# Altium schematic sheet CAM_BRD.SchDoc: SBC CAM BOARD
size Tabloid; CompanyName: Romtech; DrawnBy: FKA; DocumentNumber: 16016; Revision: 2; SheetNumber: 1; SheetTotal: 1
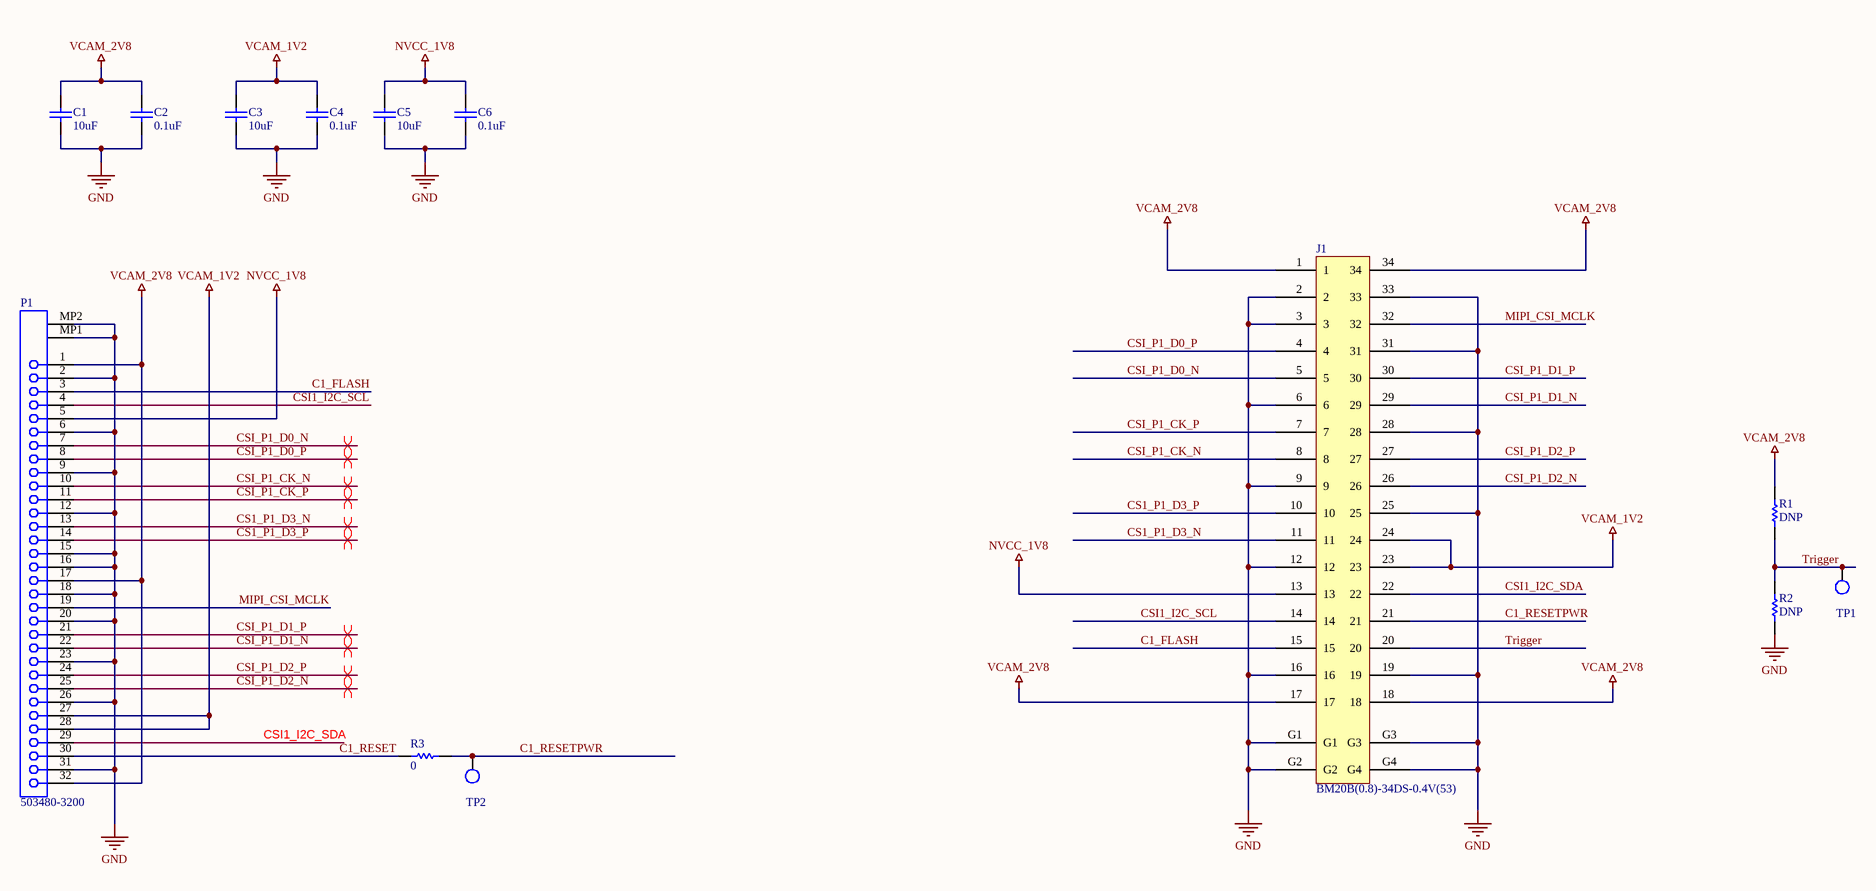
[diagram p0: CAM_BRD.SchDoc]

## Parts
C1  10uF  [CAPC0402X06N]
C2  0.1uF  [CAPC0402X06N]
C3  10uF  [CAPC0402X06N]
C4  0.1uF  [CAPC0402X06N]
C5  10uF  [CAPC0402X06N]
C6  0.1uF  [CAPC0402X06N]
J1  BM20B(0.8)-34DS-0.4V(53)  [BM20]
P1  503480-3200  [32POS-0.5MM PITCH]
R1  DNP  [RESC0402X04N]
R2  DNP  [RESC0402X04N]
R3  0  [RESC0603X06N]
TP1  (no value)  [Test Point]  (no BOM)
TP2  (no value)  [Test Point]  (no BOM)

## Nets
GND: C1.1 C2.1 C3.1 C4.1 C5.1 C6.1 J1.2 J1.3 J1.6 J1.9 J1.12 J1.16 J1.19 J1.25 J1.28 J1.31 J1.33 J1.G1 J1.G2 J1.G3 J1.G4 P1.2 P1.6 P1.9 P1.12 P1.15 P1.16 P1.18 P1.20 P1.23 P1.26 P1.31 P1.MP1 P1.MP2 R2.1
NVCC_1V8: C5.2 C6.2 J1.13 P1.5
VCAM_1V2: C3.2 C4.2 J1.23 J1.24 P1.27 P1.28
VCAM_2V8: C1.2 C2.2 J1.1 J1.17 J1.18 J1.34 P1.1 P1.17 P1.32 R1.2
C1_FLASH: J1.15 P1.3
C1_RESET: P1.30 R3.1
C1_RESETPWR: J1.21 R3.2 TP2.1
CS1_P1_D3_N: J1.11 P1.13
CS1_P1_D3_P: J1.10 P1.14
CSI1_I2C_SCL: J1.14 P1.4
CSI1_I2C_SDA: J1.22 P1.29
CSI_P1_CK_N: J1.8 P1.10
CSI_P1_CK_P: J1.7 P1.11
CSI_P1_D0_N: J1.5 P1.7
CSI_P1_D0_P: J1.4 P1.8
CSI_P1_D1_N: J1.29 P1.22
CSI_P1_D1_P: J1.30 P1.21
CSI_P1_D2_N: J1.26 P1.25
CSI_P1_D2_P: J1.27 P1.24
MIPI_CSI_MCLK: J1.32 P1.19
Trigger: J1.20 R1.1 R2.2 TP1.1

## Layout directives
differential pair: CS1_P1_D3_N, CS1_P1_D3_P, CSI_P1_CK_N, CSI_P1_CK_P, CSI_P1_D0_N, CSI_P1_D0_P, CSI_P1_D1_N, CSI_P1_D1_P, CSI_P1_D2_N, CSI_P1_D2_P

## Library data of the parts
C1 C3 C5 = Cap NP: CAP CER 10UF 10V X5R 0402; Manufacturer 1: Murata Electronics; Manufacturer Part Number 1: GRM155R61A106ME11D; Value: 10uF
C2 C4 C6 = Cap NP: CAP CER 0.1UF 10V X7R 0402; Manufacturer 1: Samsung Electro-Mechanics; Manufacturer Part Number 1: CL05B104KP5NNNC; Value: 0.1uF
J1 = BM20B(0.8)-34DS-0.4V(53): 34 Position Connector Receptacle, Center Strip Contacts Surface Mount Gold; Manufacturer 1: Hirose Electric Co Ltd; Manufacturer Part Number 1: BM20B(0.8)-34DS-0.4V(53)
P1 = 503480-3200: 0.5 mm Pitch Easy-On(TM) BackFlip(TM) Type FPC Connector, 1.0 mm Mated Height, Right Angle, SMT, Dual Contact, 32 Circuits, -40 to 85 degC, ELV and RoHS Compliant, Tape and Reel; Manufacturer 1: Molex; Durability (mating cycles max): 10; Mated Height: 1.00mm; Material - Metal: Phosphor Bronze; Material - Plating Termination: Gold, Tin; Polarized to PCB: Yes; Voltage (Max): 50V AC (RMS)/DC; Entry Angle: 90degrees Angle; PCB Locator: No; Current (Max per Contact): 0.5A; Material - Plating Mating: Gold; Pitch - Mating Interface: 0.50mm; Circuits (Loaded): 32; Contact Position: Dual; Manufacturer Part Number 1: 503480-3200; ComponentLink1Description: Manufacturer URL; ComponentLink2Description: Datasheet; ComponentLink3URL: http://www.molex.com/pdm_docs/sd/5034803200_sd.pdf; ComponentLink1URL: http://www.molex.com/molex/index.jsp; Packing: Tape and Reel; Number of Rows: 1; ComponentLink2URL: http://www.molex.com/webdocs/datasheets/pdf/en-us/5034803200_FFC_FPC_CONNECTORS.pdf; PackageReference: 503480-3200; ComponentLink3Description: Package Specification; PackageVersion: Rev. F, 09/2012; RoHS: TRUE; PCB Retention: Yes; Orientation: Right Angle; Stackable: No; Mounting Technology: Surface Mount; PackageDescription: 32-Lead FPC Connector, Pitch 0.5 mm
R1 R2 = Res: Resistor; VALUE: DNP
R3 = Res: RES 0 OHM JUMPER 1/10W 0603; Manufacturer Part Number 1: RMCF0603ZT0R00; Manufacturer 1: Stackpole Electronics Inc; VALUE: 0
TP1 TP2 = Test: Test point